# Altium schematic sheet Gate Connector.SchDoc
size A; SheetNumber: 5; SheetTotal: 9
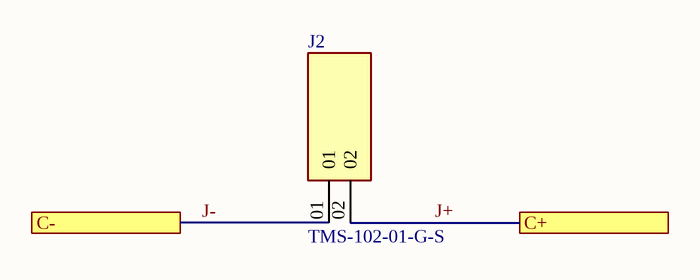
[diagram p0: Gate Connector.SchDoc]

## Parts
J2  TMS-102-01-G-S  [SAMTEC_TMS-102-01-G-S]

## Ports
C+, C-

## Nets
J+: J2.02 ; port C+
J-: J2.01 ; port C-

## Library data of the parts
J2 = TMS-102-01-G-S: Connector Header position; MF: Samtec; Package: None; Value: *; Toby_UK-Purchase-URL: https://snapeda.com/shop?store=Toby+UK&id=564083; Availability: Unavailable; SnapEDA_Link: https://www.snapeda.com/parts/TMS-102-01-G-S/Samtec%20Inc./view-part/564083/?ref=snap; Price: None; MP: TMS-102-01-G-S